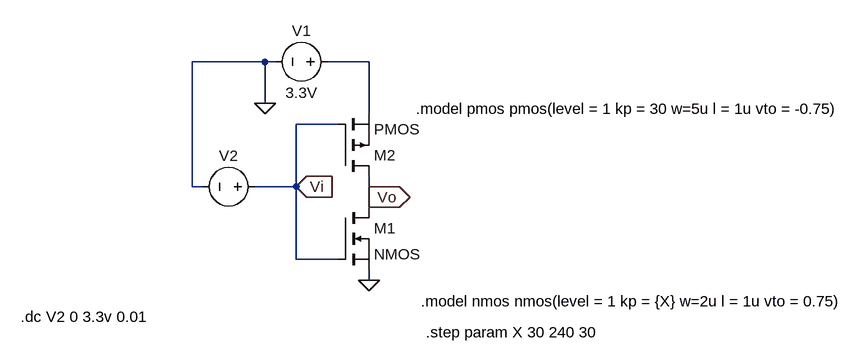
[diagram p0: schematic Draft4.asc]
Draft4.asc, the LTspice schematic file:
Version 4
SHEET 1 900 680
WIRE -112 -240 -224 -240
WIRE -96 -240 -112 -240
WIRE 48 -240 -16 -240
WIRE -112 -176 -112 -240
WIRE 48 -160 48 -240
WIRE 0 -144 -64 -144
WIRE -224 -48 -224 -240
WIRE -208 -48 -224 -48
WIRE -64 -48 -64 -144
WIRE -64 -48 -128 -48
WIRE 48 -32 48 -64
WIRE 48 -16 48 -32
WIRE -64 64 -64 -48
WIRE 0 64 -64 64
WIRE 48 96 48 80
FLAG 48 96 0
FLAG -112 -176 0
FLAG -64 -48 Vi
IOPIN -64 -48 In
FLAG 48 -32 Vo
IOPIN 48 -32 Out
SYMBOL nmos 0 -16 R0
SYMATTR InstName M1
SYMBOL pmos 0 -64 M180
SYMATTR InstName M2
SYMBOL voltage 0 -240 R90
WINDOW 0 -32 56 VBottom 2
WINDOW 3 32 56 VTop 2
SYMATTR InstName V1
SYMATTR Value 3.3V
SYMBOL voltage -112 -48 R90
WINDOW 0 -32 56 VBottom 2
WINDOW 3 71 131 VTop 2
WINDOW 123 0 0 Left 2
WINDOW 39 0 0 Left 2
SYMATTR InstName V2
SYMATTR Value ""
TEXT 128 128 Left 2 !.model nmos nmos(level = 1 kp = {X} w=2u l = 1u vto = 0.75)
TEXT 120 -168 Left 2 !.model pmos pmos(level = 1 kp = 30 w=5u l = 1u vto = -0.75)
TEXT -488 152 Left 2 !.dc V2 0 3.3v 0.01
TEXT 136 176 Left 2 !.step param X 30 240 30

The netlist it stands for:
* Draft4.asc
M1 Vo Vi 0 0 NMOS
M2 Vo Vi N001 N001 PMOS
V1 N001 0 3.3V
V2 Vi 0
.model NMOS NMOS
.model PMOS PMOS
.lib standard.mos
.model nmos nmos(level = 1 kp = {X} w=2u l = 1u vto = 0.75)
.model pmos pmos(level = 1 kp = 30 w=5u l = 1u vto = -0.75)
.dc V2 0 3.3v 0.01
.step param X 30 240 30
.backanno
.end

* Results of the author's LTspice run, read from the files saved beside the schematic
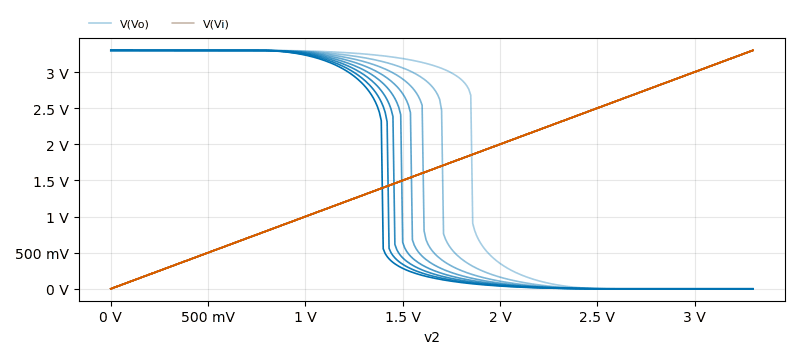
[diagram p1: DC transfer characteristic of Draft4.asc, plotted from the saved traces]
* DC transfer characteristic, 15 runs:
*   V(Vo) [run 1]: 3.3 V at v2=0 V, 43.2 fV at v2=3.3 V, min -5.542 nV, max 3.3 V
*   V(Vo) [run 2]: 3.3 V at v2=0 V, 3.3 V at v2=0 V, min 3.3 V, max 3.3 V
*   V(Vo) [run 3]: 3.3 V at v2=0 V, 21.6 fV at v2=3.3 V, min -1.385 nV, max 3.3 V
*   V(Vo) [run 4]: 3.3 V at v2=0 V, 3.3 V at v2=0 V, min 3.3 V, max 3.3 V
*   V(Vo) [run 5]: 3.3 V at v2=0 V, 14.4 fV at v2=3.3 V, min -615.7 pV, max 3.3 V
*   V(Vo) [run 6]: 3.3 V at v2=0 V, 3.3 V at v2=0 V, min 3.3 V, max 3.3 V
*   V(Vo) [run 7]: 3.3 V at v2=0 V, 10.8 fV at v2=3.3 V, min -346.3 pV, max 3.3 V
*   V(Vo) [run 8]: 3.3 V at v2=0 V, 3.3 V at v2=0 V, min 3.3 V, max 3.3 V
*   V(Vi) [run 1]: 0 V at v2=0 V, 3.3 V at v2=3.3 V, min 0 V, max 3.3 V
*   V(Vi) [run 2]: 0 V at v2=0 V, 0 V at v2=0 V, min 0 V, max 0 V
*   V(Vi) [run 3]: 0 V at v2=0 V, 3.3 V at v2=3.3 V, min 0 V, max 3.3 V
*   V(Vi) [run 4]: 0 V at v2=0 V, 0 V at v2=0 V, min 0 V, max 0 V
*   V(Vi) [run 5]: 0 V at v2=0 V, 3.3 V at v2=3.3 V, min 0 V, max 3.3 V
*   V(Vi) [run 6]: 0 V at v2=0 V, 0 V at v2=0 V, min 0 V, max 0 V
*   V(Vi) [run 7]: 0 V at v2=0 V, 3.3 V at v2=3.3 V, min 0 V, max 3.3 V
*   V(Vi) [run 8]: 0 V at v2=0 V, 0 V at v2=0 V, min 0 V, max 0 V